# Altium schematic sheet 03_ICs.SchDoc: ICs
size A; Revision: A; SheetNumber: 3; SheetTotal: 4; ECE315_Project_Name: ECE453 F23 Base Project
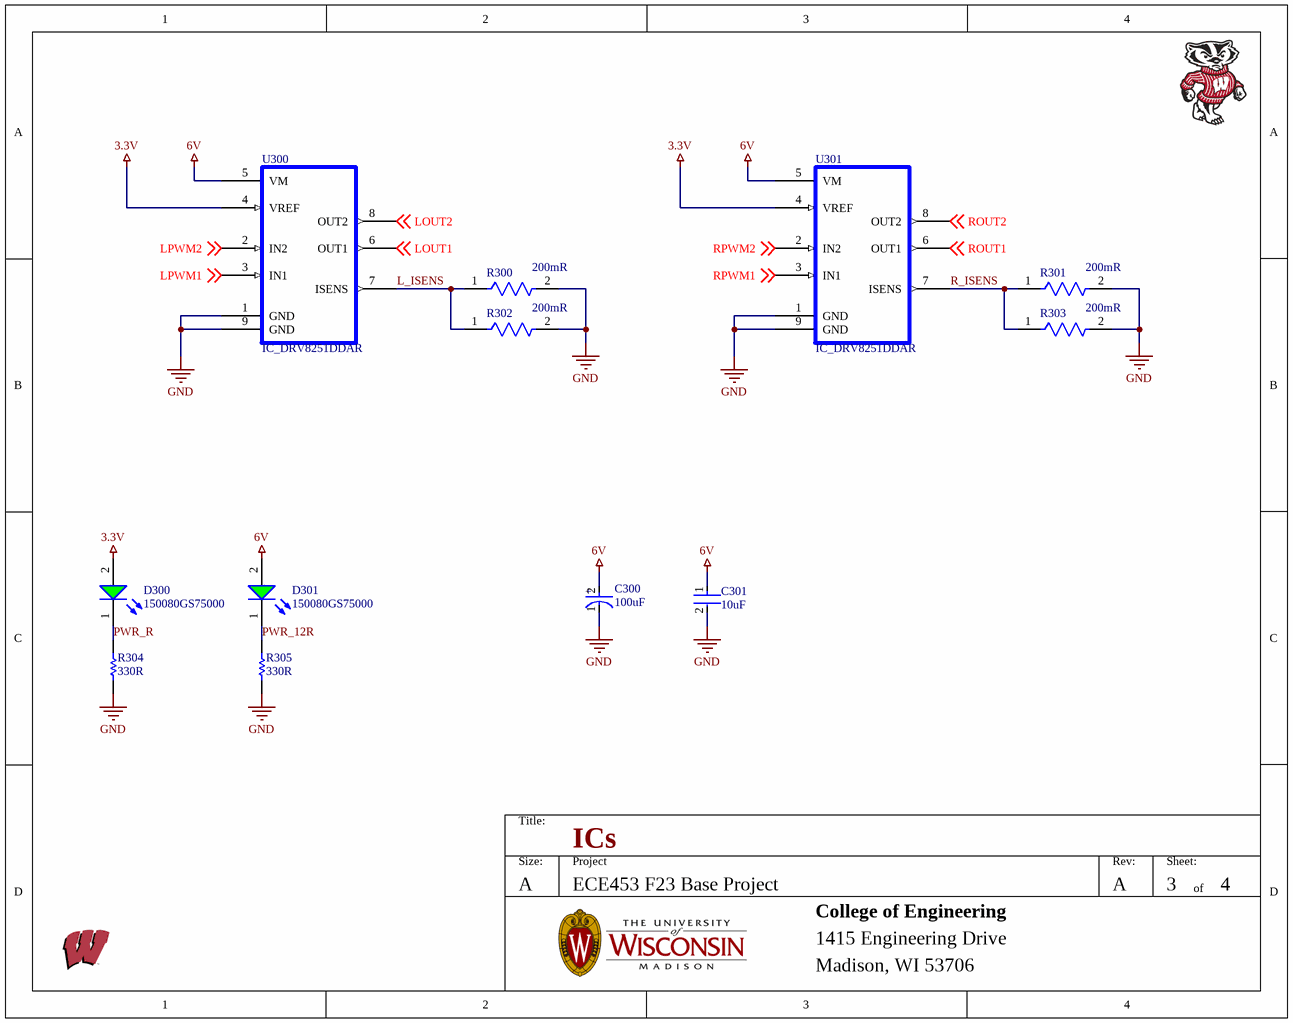
[diagram p0: 03_ICs.SchDoc]

## Parts
C300  100uF  [FP-SD8-MFG]
C301  10uF  [FP-C0805C-DG-MFG]
D300  150080GS75000  [WL-SMCW_0805_150080xx75000]
D301  150080GS75000  [WL-SMCW_0805_150080xx75000]
R300  200mR  [FP-CSR0805-IPC_C]
R301  200mR  [FP-CSR0805-IPC_C]
R302  200mR  [FP-CSR0805-IPC_C]
R303  200mR  [FP-CSR0805-IPC_C]
R304  330R  [RESC2013X60X40LL20T25]
R305  330R  [RESC2013X60X40LL20T25]
U300  IC_DRV8251DDAR  [SOIC_8_PP]
U301  IC_DRV8251DDAR  [SOIC_8_PP]

## Nets
3.3V: D300.2(A) U300.4(VREF) U301.4(VREF)
6V: C300.2(A) C301.1 D301.2(A) U300.5(VM) U301.5(VM)
GND: C300.1(C) C301.2 R300.2 R301.2 R302.2 R303.2 R304.2 R305.2 U300.1(GND) U300.9(GND) U301.1(GND) U301.9(GND)
L_ISENS: R300.1 R302.1 U300.7(ISENS)
LOUT1: U300.6(OUT1) ; off-sheet LOUT1
LOUT2: U300.8(OUT2) ; off-sheet LOUT2
LPWM1: U300.3(IN1) ; off-sheet LPWM1
LPWM2: U300.2(IN2) ; off-sheet LPWM2
PWR_12R: D301.1(K) R305.1
PWR_R: D300.1(K) R304.1
R_ISENS: R301.1 R303.1 U301.7(ISENS)
ROUT1: U301.6(OUT1) ; off-sheet ROUT1
ROUT2: U301.8(OUT2) ; off-sheet ROUT2
RPWM1: U301.3(IN1) ; off-sheet RPWM1
RPWM2: U301.2(IN2) ; off-sheet RPWM2

## Notes on the sheet
- Title:
- Size:
- A
- Project
- Rev:
- Sheet:
- of
- College of Engineering
- 1415 Engineering Drive
- Madison, WI 53706
- (in symbol CMP-05427-000061-1) +

## Library data of the parts
C300 = CMP-05427-000061-1: CAP ALUM 100UF 20% 25V SMD; Manufacturer: Panasonic; Manufacturer Part Number: EEE-1EA101XP; Leakage Current: 3uA; Life (Hours): 2000Hour; Ripple Current: 143mA; Polarity: Polar; Dissipation Factor: 14%; Height - Seated (Max): 0.303inch; Contact Plating: Tin; Max Operating Temperature: 85°C; Package Quantity: 900; RoHS Compliant: Yes; Termination: SMD/SMT; Lead Free: Lead Free; Min Operating Temperature: -40°C; Radiation Hardening: No; Length: 8mm; Height: 7.7mm; Series: S; Voltage Rating: 25V; Capacitance: 100uF; Diameter: 6.3mm; Ripple Current (AC): 143mA; Case/Package: Radial; Packaging: Tape and Reel; Voltage: 25V; Tolerance: 20%; Construction: Cylindrical; Voltage Rating (DC): 25V; Mount: Surface Mount; Supplier: Digikey; Supplier Part Number: PCE3898CT-ND; RoHS: Yes; Category: Aluminum Electrolytic Capacitors; Stock: 37921; Pricing: 1=0.51, 10=0.338, 50=0.2488, 100=0.2025 (USD); Mounting Technology: Surface Mount,PCB; Value: 100uF; Ratings: AEC-Q200; Reach SVHC Compliant: Unknown; ComponentLink1URL: https://datasheet.ciiva.com/30108/11aba0000ce2-30108047.pdf?src-supplier=Onlinecomponents.com; ComponentLink1Description: https://datasheet.ciiva.com/30108/11aba0000ce2-30108047.pdf?src-supplier=Onlinecomponents.com; ComponentLink2URL: https://datasheet.ciiva.com/16201/aba0000ce2-16201065.pdf?src-supplier=Future+Electronics; ComponentLink2Description: https://datasheet.ciiva.com/16201/aba0000ce2-16201065.pdf?src-supplier=Future+Electronics; ComponentLink3URL: https://datasheet.ciiva.com/24022/aba0000ce2-40801-24022875.pdf?src-supplier=Mouser; ComponentLink3Description: https://datasheet.ciiva.com/24022/aba0000ce2-40801-24022875.pdf?src-supplier=Mouser
C301 = CMP-2007-03243-2: CAP CER 10UF 10V X5R 0805; Manufacturer Part Number: C0805C106K8PACTU; Manufacturer: Kemet; 3DS Part Number: 220-00001; Tolerance: 10%; Temperature Coefficient: 15%; Material: Ceramic; Device Class L2: Capacitors; Device Class L1: Passive Components; ComponentLink2URL: https://content.kemet.com/datasheets/KEM_C1006_X5R_SMD.pdf; Height: 1.4mm; Lead Free: Yes; Digikey Description: CAP CER 10UF 10V X5R 0805; Octopart: https://octopart.com/c0805c106k8pactu-kemet-98697; Capacitance: 10uF; Value: 10uF; Temperature Range Low: -55°C; Temperature: -55°C to +85°C; Automotive: No; Mouser Description: CAP CER 10UF 10V X5R 0805; Ipc Land Pattern Name: CAPC200125X125; Temperature Range High: +85°C; Voltage: 10V; RoHS: TRUE; Device Class L3: Ceramic Capacitors; ComponentLink2Description: Datasheet; Voltage Rating: 10V; Package: C0805C-DG; Temperature Characteristic: X5R; Category: Cap; Supplier: Digikey; Supplier Part Number: 399-C0805C106K8PAC7800CT-ND; Stock: 5930250; Pricing: 1=0.14, 10=0.098, 50=0.0584, 100=0.0459, 500=0.03388, 1000=0.02805 (USD); Mounting Technology: Surface Mount; Case/Package: 0805; Pins: 2; Dielectric Material: Ceramic; Contact Plating: Tin,Matte; Case Code (Imperial): 0805; Case Code (Metric): 2012; Min Operating Temperature: -55°C; Max Operating Temperature: 85°C; Packaging: Tape and Reel; Dielectric: X5R; Voltage Rating (DC): 10V; Termination: SMD/SMT; Package Quantity: 1; Dissipation Factor: 10%; Series: C; Construction: Flat; Length: 2mm; Width: 0.049inch; Depth: 1.25mm; Thickness: 0.055inch; Radiation Hardening: No; Reach SVHC Compliant: No; RoHS Compliant: Yes; ComponentLink1URL: https://datasheet.ciiva.com/7842/1732709-7842198.pdf?src-supplier=Element14; ComponentLink1Description: https://datasheet.ciiva.com/7842/1732709-7842198.pdf?src-supplier=Element14; ComponentLink3URL: https://datasheet.ciiva.com/22704/1732709-22704859.pdf?src-supplier=Element14; ComponentLink3Description: https://datasheet.ciiva.com/22704/1732709-22704859.pdf?src-supplier=Element14; ComponentLink4URL: https://datasheet.ciiva.com/7842/40889-7842552.pdf?src-supplier=Element14; ComponentLink4Description: https://datasheet.ciiva.com/7842/40889-7842552.pdf?src-supplier=Element14
D300 D301 = CMP-1426-00007-2: NexarPartId: 29717780; Wavelength: 520nm; Forward Current: 100mA; Lens Style: Clear, Rectangular; Dominant Wavelength: 525nm; Max Junction Temperature (Tj): 95°C; Power Dissipation: 105mW; Luminous Intensity: 450mcd; Peak Wavelength: 515nm; Color: Green; Viewing Angle: 140°; Test Current: 20mA; Reverse Voltage: 5V; Forward Voltage: 3.2V; Mount: Surface Mount; REACH SVHC: Unknown; Min Operating Temperature: -40°C; Case Code (Imperial): 0805; Case/Package: 0805; Max Operating Temperature: 85°C; RoHS: Compliant; Length: 2mm; Height: 700µm; Width: 1.25mm; Case Code (Metric): 2012; Packaging: Tape and Reel; Max Reverse Voltage (DC): 5V
R300-R303 = CMP-26527-002513-1: General Purpose Thick Film Chip Resistor, 0805, 0.2Ω, 1%, 200ppm/°C, 0.25W; Manufacturer: Stackpole Electronics; Manufacturer Part Number: CSR0805FKR200; Max Power Dissipation: 250mW; Height: 0.026inch; Mount: Surface Mount; Temperature Coefficient: 200ppm/°C; Width: 0.049inch; Series: CSR; Number of Terminations: 2; RoHS Compliant: Yes; Case/Package: 0805; Resistance: 200mR; Length: 0.079inch; Max Operating Temperature: 155°C; Packaging: Tape and Reel; Resistor Type: Thick Film; Case Code (Imperial): 0805; Tolerance: 1%; Case Code (Metric): 2012; Min Operating Temperature: -55°C; Supplier: Digikey; Supplier Part Number: CSR0805FKR200CT-ND; RoHS: Yes; Category: Chip SMD Resistors; Stock: 21013; Pricing: 1=0.36, 10=0.265, 25=0.212, 50=0.1576, 100=0.1111, 250=0.09896, 500=0.08484 (USD); Mounting Technology: Surface Mount; Value: 200mR; ComponentLink1URL: https://www.seielect.com/catalog/SEI-Packaging.pdf?src-supplier=Digikey; ComponentLink1Description: https://www.seielect.com/catalog/SEI-Packaging.pdf?src-supplier=Digikey; ComponentLink2URL: https://www.seielect.com/catalog/sei-csr_csrn.pdf?src-supplier=Digikey; ComponentLink2Description: https://www.seielect.com/catalog/sei-csr_csrn.pdf?src-supplier=Digikey
R304 R305 = CMP-2001-00628-1: Manufacturer: Panasonic; Part Number: ERA6AEB331V; Manufacturer Part Number: ERA-6AEB331V; Power Rating: 125mW; Tolerance: 0.1%; Voltage Rating: 100V; Temperature Coefficient: 25ppm/°C; Supplier: Digikey; Supplier Part Number: P330DACT-ND; RoHS: Yes; Category: Chip SMD Resistors; Stock: 18932; Pricing: 1=0.13, 10=0.095, 50=0.0748, 100=0.067, 500=0.05106, 1000=0.04511 (USD); Mounting Technology: Surface Mount; Case/Package: 0805; Pins: 2; Case Code (Imperial): 0805; Case Code (Metric): 2012; Weight: 0.000194oz; Contact Plating: Tin; Min Operating Temperature: -55°C; Max Operating Temperature: 155°C; Value: 330R; Packaging: Tape and Reel; Package Quantity: 1; Resistor Type: Thin Film,Metal Film; Termination: SMD/SMT; Number of Terminations: 2; Max Power Dissipation: 125mW; Voltage Rating (DC): 100V; Features: Automotive AEC-Q200; Series: ERA; Resistance Tolerance: 0.1%; Technology: METAL FILM; Length: 2mm; Width: 1.25mm; Height: 0.5mm; Depth: 1.25mm; Ratings: AEC-Q200; Reach SVHC Compliant: No; Lead Free: Lead Free; RoHS Compliant: Yes; ComponentLink1URL: https://datasheet.ciiva.com/11808/0900766b80eb1d8c-11808093.pdf?src-supplier=Rs; ComponentLink1Description: https://datasheet.ciiva.com/11808/0900766b80eb1d8c-11808093.pdf?src-supplier=Rs; ComponentLink2URL: https://datasheet.ciiva.com/29184/452857-da-01-en-widerstand-0805-era-29184079.pdf?src-supplier=Conrad; ComponentLink2Description: https://datasheet.ciiva.com/29184/452857-da-01-en-widerstand-0805-era-29184079.pdf?src-supplier=Conrad; ComponentLink3URL: https://datasheet.ciiva.com/9182/aoa0000ce26-9182968.pdf?src-supplier=Avnet; ComponentLink3Description: https://datasheet.ciiva.com/9182/aoa0000ce26-9182968.pdf?src-supplier=Avnet; ComponentLink4URL: https://datasheet.ciiva.com/48536/era-eng-tds-48536857.pdf?src-supplier=Distrelec; ComponentLink4Description: https://datasheet.ciiva.com/48536/era-eng-tds-48536857.pdf?src-supplier=Distrelec; ComponentLink5URL: https://datasheet.ciiva.com/22759/485442-22759176.pdf?src-supplier=Farnell; ComponentLink5Description: https://datasheet.ciiva.com/22759/485442-22759176.pdf?src-supplier=Farnell; ComponentLink6URL: https://datasheet.ciiva.com/6138/485442-6138589.pdf?src-supplier=Farnell; ComponentLink6Description: https://datasheet.ciiva.com/6138/485442-6138589.pdf?src-supplier=Farnell; ComponentLink7URL: https://datasheet.ciiva.com/43457/485442-43457816.pdf?src-supplier=Farnell; ComponentLink7Description: https://datasheet.ciiva.com/43457/485442-43457816.pdf?src-supplier=Farnell; ComponentLink8URL: https://datasheet.ciiva.com/6138/485442-6138585.pdf?src-supplier=Farnell; ComponentLink8Description: https://datasheet.ciiva.com/6138/485442-6138585.pdf?src-supplier=Farnell; ComponentLink9URL: https://datasheet.ciiva.com/24164/aoa0000ce26-197354-24164407.pdf?src-supplier=Mouser; ComponentLink9Description: https://datasheet.ciiva.com/24164/aoa0000ce26-197354-24164407.pdf?src-supplier=Mouser; ComponentLink10URL: https://datasheet.ciiva.com/22744/1776116-22744153.pdf?src-supplier=Element14; ComponentLink10Description: https://datasheet.ciiva.com/22744/1776116-22744153.pdf?src-supplier=Element14
U300 U301 = IC_DRV8251DDAR: 48-V, 3.5-A H bridge motor driver with current regulation and latched OCP 8-SO PowerPAD -40 to 150; Manufacturer: Texas Instruments; Supplier: Digi-Key; Supplier Part Number: 296-DRV8251DDARCT-ND; Manufacturer Part Number: DRV8251DDAR; RoHS: No; Category: Integrated Circuits (ICs); Stock: 4730; Pricing: 1=1.66, 10=1.495, 25=1.4108, 100=1.202, 250=1.12868, 500=0.9876, 1000=0.81829 (USD)